# Altium schematic sheet Sch_Input.SchDoc
size A4; ENG_APP_DATE: --/--/--; DSN_APP_DATE: --/--/--; CHK_APP_DATE: --/--/--; CompanyName: Universidade Federal de Santa Maria; Organization: Universidade Federal de Santa Maria; Address1: Av. Roraima 1000; Address2: Camobi; Address3: Santa Maria - RS; Address4: Brasil; SheetNumber: 2; SheetTotal: 6
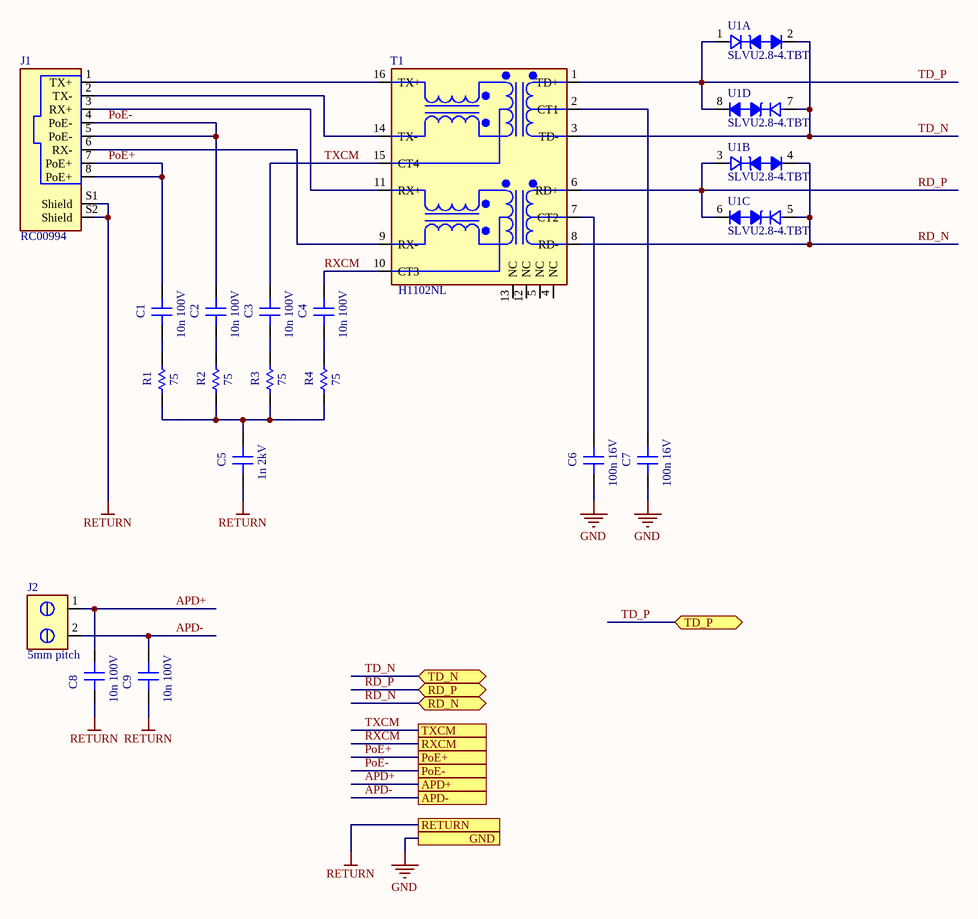
[diagram p0: Sch_Input.SchDoc]

## Parts
C1  10n 100V  [CAP_SMD_0603]
C2  10n 100V  [CAP_SMD_0603]
C3  10n 100V  [CAP_SMD_0603]
C4  10n 100V  [CAP_SMD_0603]
C5  1n 2kV  [CAP_SMD_1206]
C6  100n 16V  [CAP_SMD_0603]
C7  100n 16V  [CAP_SMD_0603]
C8  10n 100V  [CAP_SMD_0603]
C9  10n 100V  [CAP_SMD_0603]
J1  RC00994  [CON_PTH_RJ45_RC00994]
J2  5mm pitch  [CON_SCREW_5mm]
R1  75  [RES_SMD_0603]
R2  75  [RES_SMD_0603]
R3  75  [RES_SMD_0603]
R4  75  [RES_SMD_0603]
T1  H1102NL  [T_SMD_H1102NL]
U1  SLVU2.8-4.TBT  [IC_SOIC8]  (parts A,B,C,D of 4)

## Ports
APD+, APD-, GND, PoE+, PoE-, RD_N (bidir), RD_P (bidir), RETURN, RXCM, TD_N (bidir), TD_P (bidir), TXCM

## Nets
GND: C6.2 C7.2 ; port GND
RETURN: C5.2 C8.2 C9.2 J1.S1(Shield) J1.S2(Shield) ; port RETURN
APD+: C8.1 J2.1 ; port APD+
APD-: C9.1 J2.2 ; port APD-
PoE+: C1.1 J1.7(PoE+) J1.8(PoE+) ; port PoE+
PoE-: C2.1 J1.4(PoE-) J1.5(PoE-) ; port PoE-
RD_N: T1.8(RD-) U1.4 U1.5 ; port RD_N
RD_P: T1.6(RD+) U1.3 U1.6 ; port RD_P
RXCM: C4.1 T1.10(CT3) ; port RXCM
TD_N: T1.3(TD-) U1.2 U1.7 ; port TD_N
TD_P: T1.1(TD+) U1.1 U1.8 ; port TD_P
TXCM: C3.1 T1.15(CT4) ; port TXCM
NetC1_2: C1.2 R1.1
NetC2_2: C2.2 R2.1
NetC3_2: C3.2 R3.1
NetC4_2: C4.2 R4.1
NetC5_1: C5.1 R1.2 R2.2 R3.2 R4.2
NetC6_1: C6.1 T1.7(CT2)
NetC7_1: C7.1 T1.2(CT1)
NetJ1_1: J1.1(TX+) T1.16(TX+)
NetJ1_2: J1.2(TX-) T1.14(TX-)
NetJ1_3: J1.3(RX+) T1.11(RX+)
NetJ1_6: J1.6(RX-) T1.9(RX-)

Not connected (* = marked no-connect by the designer): T1 4(NC) 5(NC) 12(NC) 13(NC)

## Notes on the sheet
- Engineers
- Title
- Size:
- Date:
- A4
- Number:
- Time:
- Revision:
- Sheet
- of
- File:

## Library data of the parts
C1-C9 = CAP_SMD: Capacitor SMD - Generic
J1 = CON_PTH_RJ45_RC00994: RC00994 RJ45 connector - No LEDs
J2 = CON_SCREW-2P-5mm: 5mm pitch 2P screw terminal block
R1-R4 = RES_SMD: Resistor SMD - Generic
T1 = H1102NL: Isolation and Data Interface (Encapsulated) Pulse Transformer 1:1 Transmitter, 1:1 Receiver Surface Mount; SnapEDA_Link: https://www.snapeda.com/parts/H1102NL/Pulse/view-part/?ref=snap; Package: Non Standard Pulse; Value: *; MF: Pulse; MP: H1102NL; Check_prices: https://www.snapeda.com/parts/H1102NL/Pulse/view-part/?ref=eda
U1 = IC_SLVU2.8-4.TBT: 15V Clamp 24A (8/20µs) Ipp Tvs Diode Surface Mount 8-SO; MF: Semtech Corporation; SnapEDA_Link: https://www.snapeda.com/parts/SLVU2.8-4.TBT/Semtech/view-part/?ref=snap; Package: SOIC-8 Semtech; Value: *; MP: SLVU2.8-4.TBT; Check_prices: https://www.snapeda.com/parts/SLVU2.8-4.TBT/Semtech/view-part/?ref=eda